# Altium schematic sheet USB Port.SchDoc
size A4; SheetNumber: 4; SheetTotal: 10
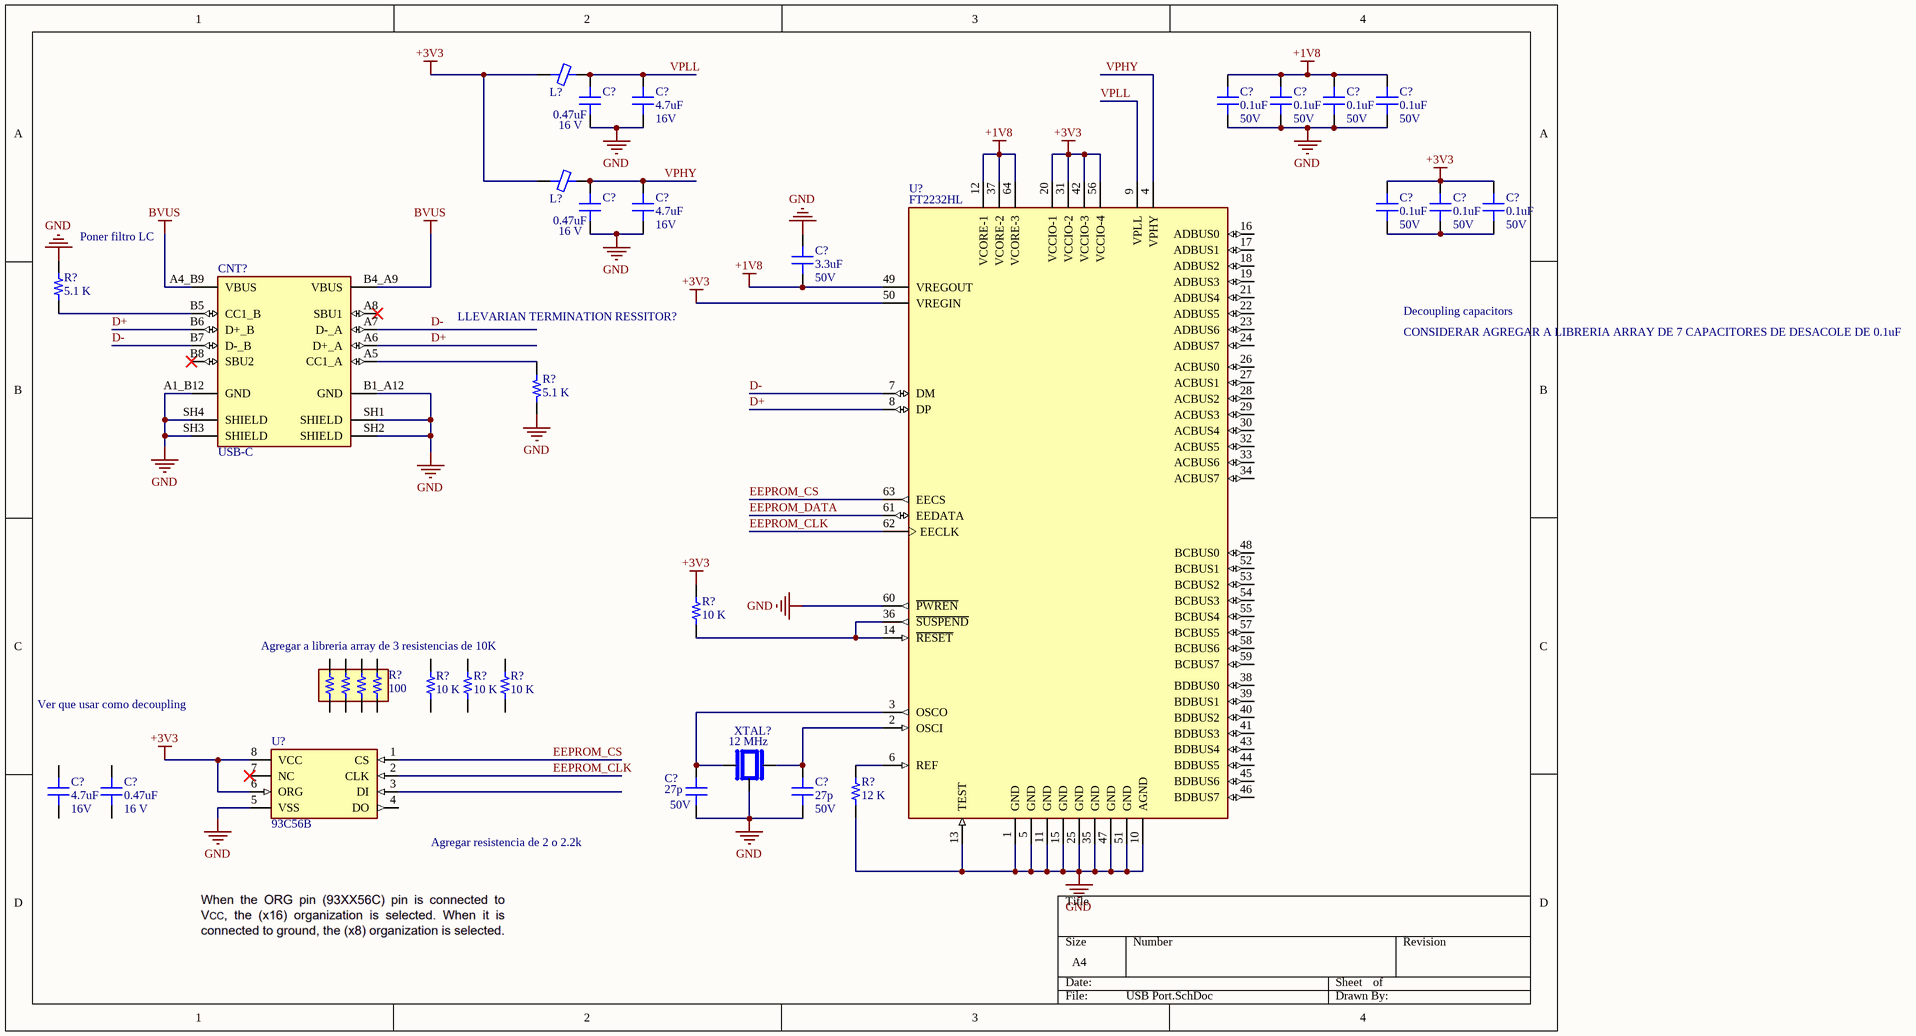
[diagram p0: USB Port.SchDoc]

## Parts
(Parts that share a designator on the sheet are numbered #1, #2 ... from top to bottom, then left to right.)
C?#1  0.47uF  Voltage: 16 V  [CAP0805]
C?#2  4.7uF  Voltage: 16V  [CAP0805]
C?#3  0.1uF  Voltage: 50V  [CAP0603]
C?#4  0.1uF  Voltage: 50V  [CAP0603]
C?#5  0.1uF  Voltage: 50V  [CAP0603]
C?#6  0.1uF  Voltage: 50V  [CAP0603]
C?#7  0.47uF  Voltage: 16 V  [CAP0805]
C?#8  4.7uF  Voltage: 16V  [CAP0805]
C?#9  0.1uF  Voltage: 50V  [CAP0603]
C?#10  0.1uF  Voltage: 50V  [CAP0603]
C?#11  0.1uF  Voltage: 50V  [CAP0603]
C?#12  3.3uF  Voltage: 50V  [CAP0603]
C?#13  4.7uF  Voltage: 16V  [CAP0805]
C?#14  0.47uF  Voltage: 16 V  [CAP0805]
C?#15  27p  Voltage: 50V  [CAP0603]
C?#16  27p  Voltage: 50V  [CAP0603]
CNT?  USB-C  [USB-C 2.0 24 PINS (16+8 DUMMY)]
L?#1  HZ0603C651R-10  [Fer0603]  (value not drawn)
L?#2  HZ0603C651R-10  [Fer0603]  (value not drawn)
R?#1  5.1 K  [RES0603]
R?#2  5.1 K  [RES0603]
R?#3  10 K  [RES0603]
R?#4  100  [ArrayResistor-1206]
R?#5  10 K  [RES0603]
R?#6  10 K  [RES0603]
R?#7  10 K  [RES0603]
R?#8  12 K  [RES0603]
U?#1  93C56B  [DFN-8]
U?#2  FT2232HL  [LQPF-64]
XTAL?  12 MHz  [XTAL_ABM8G]

## Nets
+1V8: C?#3.2 C?#4.2 C?#5.2 C?#6.2 C?#12.1 U?#2.12(VCORE-1) U?#2.37(VCORE-2) U?#2.49(VREGOUT) U?#2.64(VCORE-3)
+3V3: C?#9.2 C?#10.2 C?#11.2 L?#1.1 L?#2.1 R?#3.2 U?#1.6(ORG) U?#1.8(VCC) U?#2.20(VCCIO-1) U?#2.31(VCCIO-2) U?#2.42(VCCIO-3) U?#2.50(VREGIN) U?#2.56(VCCIO-4)
BVUS: CNT?.A4_B9(VBUS) CNT?.B4_A9(VBUS)
GND: C?#1.1 C?#2.1 C?#3.1 C?#4.1 C?#5.1 C?#6.1 C?#7.1 C?#8.1 C?#12.2 C?#15.1 C?#16.1 CNT?.A1_B12(GND) CNT?.B1_A12(GND) CNT?.SH1(SHIELD) CNT?.SH2(SHIELD) CNT?.SH3(SHIELD) CNT?.SH4(SHIELD) R?#1.2 R?#2.2 R?#8.1 U?#1.5(VSS) U?#2.1(GND) U?#2.5(GND) U?#2.10(AGND) U?#2.11(GND) U?#2.13(TEST) U?#2.15(GND) U?#2.25(GND) U?#2.35(GND) U?#2.47(GND) U?#2.51(GND) U?#2.60(~{PWREN}) XTAL?.2
D+: CNT?.A6(D+_A) CNT?.B6(D+_B) U?#2.8(DP)
D-: CNT?.A7(D-_A) CNT?.B7(D-_B) U?#2.7(DM)
EEPROM_CLK: U?#1.2(CLK) U?#2.62(EECLK)
EEPROM_CS: U?#1.1(CS) U?#2.63(EECS)
EEPROM_DATA: U?#2.61(EEDATA)
VPHY: C?#7.2 C?#8.2 L?#2.2 U?#2.4(VPHY)
VPLL: C?#1.2 C?#2.2 L?#1.2 U?#2.9(VPLL)
NetC?#9_1: C?#9.1 C?#10.1 C?#11.1
NetC?#15_2: C?#15.2 U?#2.3(OSCO) XTAL?.1
NetC?#16_2: C?#16.2 U?#2.2(OSCI) XTAL?.3
NetCNT?_A5: CNT?.A5(CC1_A) R?#2.1
NetCNT?_B5: CNT?.B5(CC1_B) R?#1.1
NetR?#3_1: R?#3.1 U?#2.14(~{RESET}) U?#2.36(~{SUSPEND})
NetR?#8_2: R?#8.2 U?#2.6(REF)

Not connected (* = marked no-connect by the designer): C?#13 1 2; C?#14 1 2; CNT? A8(SBU1)* B8(SBU2)*; R?#4 1 2 3 4 5 6 7 8; R?#5 1 2; R?#6 1 2; R?#7 1 2; U?#1 3(DI) 4(DO) 7(NC)*; U?#2 16(ADBUS0) 17(ADBUS1) 18(ADBUS2) 19(ADBUS3) 21(ADBUS4) 22(ADBUS5) 23(ADBUS6) 24(ADBUS7) 26(ACBUS0) 27(ACBUS1) 28(ACBUS2) 29(ACBUS3) 30(ACBUS4) 32(ACBUS5) 33(ACBUS6) 34(ACBUS7) 38(BDBUS0) 39(BDBUS1) 40(BDBUS2) 41(BDBUS3) 43(BDBUS4) 44(BDBUS5) 45(BDBUS6) 46(BDBUS7) 48(BCBUS0) 52(BCBUS1) 53(BCBUS2) 54(BCBUS3) 55(BCBUS4) 57(BCBUS5) 58(BCBUS6) 59(BCBUS7)

## Notes on the sheet
- (near R?#1) Poner filtro LC
- Decoupling capacitors
- (near R?#2) LLEVARIAN TERMINATION RESSITOR?
- CONSIDERAR AGREGAR A LIBRERIA ARRAY DE 7 CAPACITORES DE DESACOLE DE 0.1uF
- (near R?#5) Agregar a libreria array de 3 resistencias de 10K
- Ver que usar como decoupling
- Agregar resistencia de 2 o 2.2k

## Library data of the parts
C?#1 C?#7 C?#14 = C0805C474K4RACTU: SMD Comm X7R, Ceramic, 0.47 uF, 10%, 16 VDC, X7R, SMD, MLCC, Temperature Stable, Class II, 0805; ComponentLink1Description: DataSheet; ComponentLink1URL: https://content.kemet.com/datasheets/KEM_C1002_X7R_SMD.pdf; Size: 0805; ComponentLink2Description: DigiKey; ComponentLink2URL: https://www.digikey.com/es/products/detail/kemet/C0805C474K4RAC7800/2212885?s=N4IgTCBcDaIMIAYAcCCscAsB2DBpDASgIJwAqAqiALoC%2BQA; ComponentLink3Description: ProductPage; ComponentLink3URL: https://www.kemet.com/en/us/product/C0805C474K4RACTU.html; PartNumber: C0805C474K4RACTU
C?#2 C?#8 C?#13 = C0805C475K4RACTU: SMD Comm X7R, Ceramic, 4.7 uF, 10%, 16 VDC, X7R, SMD, MLCC, Temperature Stable, Class II, 0805; Variation: +/- 10%; ComponentLink1Description: DataSheet; ComponentLink1URL: https://content.kemet.com/datasheets/KEM_C1002_X7R_SMD.pdf; Size: 0805; ComponentLink2Description: DigiKey; ComponentLink2URL: https://www.digikey.com/es/products/detail/kemet/C0805C475K4RAC7800/3317621?s=N4IgTCBcDaIMIAYAcCCscAsB2VBpDASgIJwAqAqiALoC%2BQA; PartNumber: C0805C475K4RACTU; ComponentLink3Description: ProdructPage; ComponentLink3URL: https://www.kemet.com/en/us/product/C0805C475K4RACTU.html; Capacitance: 4.7 uF
C?#3-C?#6 C?#9-C?#11 = C0603C104K4RAC7867: CAP CER 0.1UF 16V X7R 0603; ComponentLink1Description: DataSheet; ComponentLink1URL: https://content.kemet.com/datasheets/KEM_C1002_X7R_SMD.pdf; Size: 0603; ComponentLink2Description: DigiKey; ComponentLink2URL: https://www.digikey.com/en/products/detail/kemet/C0603C104K4RAC7867/411095
C?#12 = C0603C332K5RAC7867: 3.3 uF ±10% 50V Ceramic Capacitor X7R 0603 (1608 Metric); ComponentLink1Description: DataSheet; ComponentLink1URL: https://content.kemet.com/datasheets/KEM_C1002_X7R_SMD.pdf; Size: 0603; ComponentLink2Description: DigiKey; ComponentLink2URL: https://www.digikey.com/en/products/detail/kemet/C0603C332K5RAC7867/411085?s=N4IgTCBcDaIMIAYBsCDMdWrAaQKwCUBBOAdgA4kSQBdAXyA; Value: 3.3 uF; PartNumber: C0603C332K5RAC7867; Variation: 10%
C?#15 C?#16 = C0603C270K5RAC7867: CAP CER 27PF 50V X7R 0603; ComponentLink1Description: DataSheet; ComponentLink1URL: https://content.kemet.com/datasheets/KEM_C1002_X7R_SMD.pdf; Size: 0603; ComponentLink2Description: DigiKey; ComponentLink2URL: https://www.digikey.com/en/products/detail/kemet/C0603C270K5RAC7867/9923545?s=N4IgTCBcDaIMIAYBsCDMcwHYEGkCsASgIJyYAcSmIAugL5A
CNT? = USB-C: CONN USB2.0, TYP C, 24 PINS (16+8 DUMMY), SMD, RIGHT ANGLE; ComponentLink1Description: DigiKey; ComponentLink1URL: https://www.digikey.com/en/products/detail/amphenol-cs-commercial-products/12402012E212A/13683192; ComponentLink2Description: DataSheet; ComponentLink2URL: https://mm.digikey.com/Volume0/opasdata/d220001/medias/docus/2614/C12402012-4.pdf; Type: C 2.0; Pins: 24 (16+8 DUMMY)
L?#1 L?#2 = HZ0603C651R-10: FERRITE BEAD 650 OHM 0603 1LN 0603; Z@100MHz: 650 Ohms; Current: 300 mA; DCR: 0.6 Ohm; ComponentLink1Description: DataSheet; ComponentLink1URL: https://www.laird.com/sites/default/files/hz0603c651r-10-datasheet.pdf; ComponentLink2Description: DigiKey; ComponentLink2URL: https://www.digikey.com/es/products/detail/laird-signal-integrity-products/HZ0603C651R-10/806620?s=N4IgTCBcDaIBIC0AMA2JBmAwigrARgCUBaPJEAXQF8g; PartNumber: HZ0603C651R-10; Size: 0603
R?#1 R?#2 = CRCW06035K10FKEA: RES SMD 5.1K OHM 1% 1/10W 0603; Value: 47 K; ComponentLink1Description: DataSheet; ComponentLink1URL: https://www.vishay.com/docs/20035/dcrcwe3.pdf; Size: 0603; ComponentLink2Description: DigiKey; ComponentLink2URL: https://www.digikey.com/es/products/detail/vishay-dale/crcw06035k10fkea/1174748
R?#3 R?#5-R?#7 = CRCW060310K0FKEA: RES SMD 10K OHM 1% 1/10W 0603; ComponentLink1Description: DataSheet; ComponentLink1URL: https://www.vishay.com/docs/20035/dcrcwe3.pdf; Size: 0603; ComponentLink2Description: DigiKey; ComponentLink2URL: https://www.digikey.com/en/products/detail/vishay-dale/CRCW060310K0FKEA/1174782
R?#4 = EXB-38V101JV: RES ARRAY 4 RES 100 OHM 1206; Elements: 4; Value: 100 Ohms; ComponentLink1Description: DigiKey; ComponentLink1URL: https://www.digikey.com/en/products/detail/panasonic-electronic-components/EXB-38V101JV/256519?s=N4IgTCBcDaIKIA0BCBaAzADgGoEYAMOAUliALoC%2BQA; ComponentLink2Description: DataSheet; ComponentLink2URL: https://industrial.panasonic.com/cdbs/www-data/pdf/AOC0000/AOC0000C14.pdf; Size: 1206
R?#8 = CRCW060312K0FKEA: RES SMD 12K OHM 1% 1/10W 0603; ComponentLink1Description: DataSheet; ComponentLink1URL: https://www.vishay.com/docs/20035/dcrcwe3.pdf; Size: 0603; ComponentLink2Description: DigiKey; ComponentLink2URL: https://www.digikey.com/en/products/detail/vishay-dale/CRCW060312K0FKEA/1174790
U?#1 = EEPROM: 2K Microwire Compatible Serial EEPROM; ComponentLink1Description: DataSheet; ComponentLink1URL: https://www.snapeda.com/parts/93C56BT-I/MC/Microchip/datasheet/
U?#2 = FT2232HL: Dual High Speed USB to Multipurpose UART/FIFO IC; Manufacturer: FTDI Chip; ComponentLink1Description: DataSheet; ComponentLink1URL: https://ftdichip.com/wp-content/uploads/2020/07/DS_FT2232H.pdf; ComponentLink2Description: DigiKey; ComponentLink2URL: https://www.digikey.com/en/products/detail/ftdi-future-technology-devices-international-ltd/FT2232HL-REEL/1986053; Package: LQFP-64; PartNumber: FT2232HL
XTAL? = XTAL_12MHz: Crystal 12 MHz; Manufacturer: Abracom; ComponentLink1Description: DataDheet; ComponentLink1URL: https://www.snapeda.com/parts/ABM8G-16.000MHZ-B4Y-T/Abracon/datasheet/; Frequency: 12 MHz; Series: ABM8G